# Altium schematic sheet SHT_5_I_Controller_07349-R5_L10.SchDoc
size B; CompanyName: Microchip Technology Inc.; Organization: Microchip Technology; Address1: 2355 West Chandler Blvd.; Address2: Chandler, AZ  85224; Address4: USA; SheetNumber: 5; SheetTotal: 9; SheetTitle: Current Measurement Control; Time: Time
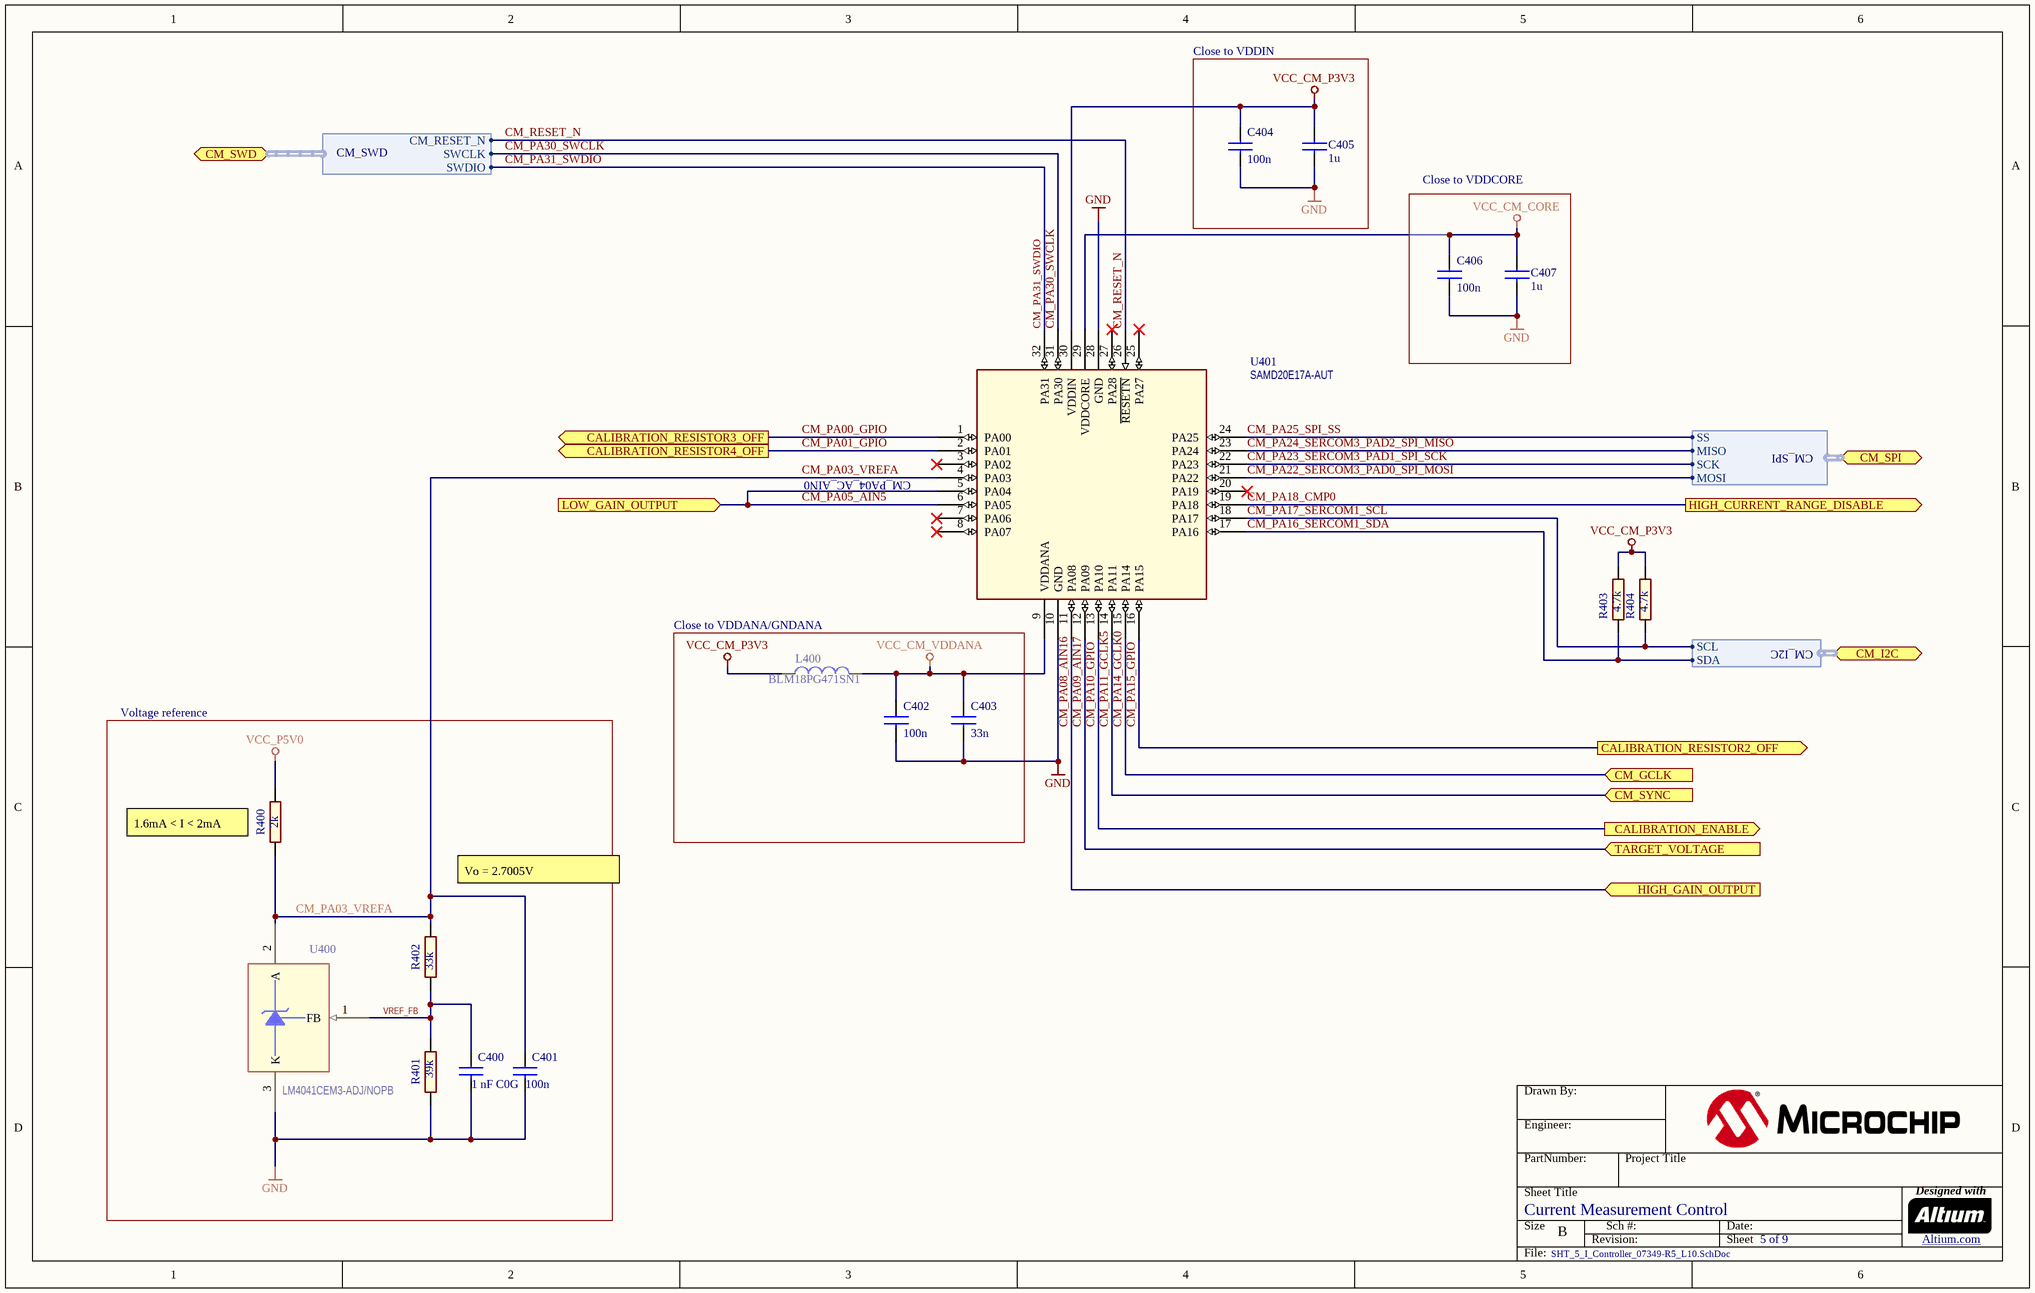
[diagram p0: SHT_5_I_Controller_07349-R5_L10.SchDoc]

## Parts
?  (no value)  (graphical)
C400  value 1 nF C0G  [AP1-00053]  (hidden comment: CAP-NONPOL)
C401  value 100n  [AP1-00053]
C402  value 100n  [AP1-00053]
C403  value 33n  [AP1-00053]
C404  value 100n  [AP1-00053]
C405  value 1u  [AP1-00001]  (hidden comment: CAP-NONPOL)
C406  value 100n  [AP1-00053]
C407  value 1u  [AP1-00001]  (hidden comment: CAP-NONPOL)
L400  value BLM18PG471SN1  [AP3-00005]
R400  value 2k  [AP2-00011]
R401  value 39k  [AP2-00011]
R402  value 33k  [AP2-00011]
R403  value 4.7k  [AP2-00011]
R404  value 4.7k  [AP2-00011]
U400  value LM4041CEM3-ADJ/NOPB  [AP5-00002]  (hidden comment: Updated with No-Pb part number and Texas Instruments mfc.)
U401  value SAMD20E17A-AUT  [AP6-00061]  (hidden comment: *)

## Blocks framed on the sheet
Close to VDDIN: C404 C405
Close to VDDCORE: C406 C407
Close to VDDANA/GNDANA: C402 C403 L400
Voltage reference: C400 C401 R400-R402 U400

## Ports
CALIBRATION_ENABLE (out), CALIBRATION_RESISTOR2_OFF (out), CALIBRATION_RESISTOR3_OFF (out), CALIBRATION_RESISTOR4_OFF (out), CM_GCLK (in), CM_I2C (harness CM_I2C), CM_SPI (harness CM_SPI), CM_SWD (harness CM_SWD), CM_SYNC (in), HIGH_CURRENT_RANGE_DISABLE (out), HIGH_GAIN_OUTPUT (in), LOW_GAIN_OUTPUT (in), TARGET_VOLTAGE (in)

## Harnesses
CM_SPI: MISO, MOSI, SCK, SS
CM_I2C: SCL, SDA
CM_SWD: SWCLK, SWDIO, CM_RESET_N

## Nets
GND: C400.2 C401.2 C402.2 C403.2 C404.2 C405.2 C406.2 C407.2 R401.1 U400.3(K) U401.10(GND) U401.28(GND)
VCC_CM_CORE: C406.1 C407.1 U401.29(VDDCORE)
VCC_CM_P3V3: C404.1 C405.1 L400.1 R403.2 R404.2 U401.30(VDDIN)
VCC_CM_VDDANA: C402.1 C403.1 L400.2 U401.9(VDDANA)
VCC_P5V0: R400.2
CM_PA00_GPIO: U401.1(PA00) ; port CALIBRATION_RESISTOR3_OFF
CM_PA01_GPIO: U401.2(PA01) ; port CALIBRATION_RESISTOR4_OFF
CM_PA03_VREFA: C401.1 R400.1 R402.2 U400.2(A) U401.4(PA03)
CM_PA05_AIN5: U401.5(PA04) U401.6(PA05) ; port LOW_GAIN_OUTPUT
CM_PA08_AIN16: U401.11(PA08) ; port HIGH_GAIN_OUTPUT
CM_PA09_AIN17: U401.12(PA09) ; port TARGET_VOLTAGE
CM_PA10_GPIO: U401.13(PA10) ; port CALIBRATION_ENABLE
CM_PA11_GCLK5: U401.14(PA11) ; port CM_SYNC
CM_PA14_GCLK0: U401.15(PA14) ; port CM_GCLK
CM_PA15_GPIO: U401.16(PA15) ; port CALIBRATION_RESISTOR2_OFF
CM_PA16_SERCOM1_SDA: R403.1 U401.17(PA16) ; port CM_I2C.SDA
CM_PA17_SERCOM1_SCL: R404.1 U401.18(PA17) ; port CM_I2C.SCL
CM_PA18_CMP0: U401.19(PA18) ; port HIGH_CURRENT_RANGE_DISABLE
CM_PA22_SERCOM3_PAD0_SPI_MOSI: U401.21(PA22) ; port CM_SPI.MOSI
CM_PA23_SERCOM3_PAD1_SPI_SCK: U401.22(PA23) ; port CM_SPI.SCK
CM_PA24_SERCOM3_PAD2_SPI_MISO: U401.23(PA24) ; port CM_SPI.MISO
CM_PA25_SPI_SS: U401.24(PA25) ; port CM_SPI.SS
CM_PA30_SWCLK: U401.31(PA30) ; port CM_SWD.SWCLK
CM_PA31_SWDIO: U401.32(PA31) ; port CM_SWD.SWDIO
CM_RESET_N: U401.26(~{RESETN}) ; port CM_SWD.CM_RESET_N
VREF_FB: C400.1 R401.2 R402.1 U400.1(FB)

Not connected (* = marked no-connect by the designer): U401 3(PA02)* 7(PA06)* 8(PA07)* 20(PA19)* 25(PA27)* 27(PA28)*

## Notes on the sheet
- CM_PA04_AC_AIN0
- (near R400) 1.6mA < I < 2mA
- Vo = 2.7005V
- Drawn By:
- Engineer:
- PartNumber:
- Project Title
- Sheet Title
- Size
- B
- Revision:
- Sch #:
- Date:
- Sheet
- Designed with
- Altium.com <http://go.altium.com/MicrochipLandingPage_Evaluation.html>
- File:

## Library data of the parts
? = Title Block B
C400 = A01-0321: Ceramic capacitor, SMD 0402, C0G, 50V, +/-5%; PartGroup: Capacitors,Ceramic,SMD 0402; Manufacturer: Murata; MPN: GRM1555C1H102JA01D; Tolerance: 5%; ComponentStatus: 'Active (verified)'; Status: Active; Verified by: Lars Helge Mo; Verified date: 2005-12-15; AN: A01-0321; Height: 0.550000011920929; FootprintStatus: 'Active (Verified)'
C401 C402 C404 C406 = A01-0246: Ceramic capacitor, SMD 0402, X7R, 16V, +/-10%; PartGroup: Capacitors,Ceramic,SMD 0402; Manufacturer: Kemet; MPN: C0402C104K4RACTU; TemperatureRange: -55 - +125 deg C; ComponentStatus: 'Active (verified)'; Status: Active; Verified by: Lars Helge Mo; Verified date: 2005-12-15; AN: A01-0246; Tolerance: 16V, +/-10%; Height: 0.5; FootprintStatus: 'Active (Verified)'
C403 = A01-0397: Ceramic capacitor, SMD 0402, X7R, 25V, ±10%; PartGroup: Capacitors,Ceramic,SMD 0402; Manufacturer: Murata; MPN: GRM155R71E333KA88D; Tolerance: ±10%(K); TemperatureRange: -55 to 125°C; ComponentStatus: 'Active (verified)'; Status: Active; Verified by: Lars Helge Mo; Verified date: 2005-12-15; AN: A01-0397; Height: 0.5; FootprintStatus: 'Active (Verified)'
C405 C407 = A01-0286: Ceramic capacitor, SMD 0402, X5R, 6.3V, +/-10% (de26942); PartGroup: Capacitors,Ceramic,SMD 0402; Manufacturer: Kemet; MPN: C0402C105K9PAC; ComponentStatus: 'Active (verified)'; TemperatureRange: -55 to 85 deg C; Status: Active; Verified by: Lars Helge Mo; Verified date: 2005-12-15; AN: A01-0286; Tolerance: +/-10%; Height: 0.5; FootprintStatus: 'Active (Verified)'
L400 = A03-0035: SMD RF inductor 0603. Z=470Ohm (@100MHz), Max R(dc)=0.65Ohm, Max current=1A; PartGroup: Inductors,EMI; Manufacturer: Murata; TemperatureRange: -55; ComponentStatus: 'Active (verified)'; Verified date: 2006-01-30; Verified by: Lars Helge Mo; Status: Active; AN: A03-0035; Height: 0,800000011920929; MPN: BLM18PG471SN1; FootprintStatus: 'Active (Verified)'
R400 = A02-0219: Thick film resistor, SMD 0402, 1/16W, 1%; PartGroup: Resistors,SMD,0402 1%; MPN: RC0402FR-072KL; Manufacturer: YAGEO CORP; TemperatureRange: -55 - +125 deg C; ComponentStatus: 'Active (verified)'; Status: Active; Verified by: Lars Helge Mo; Verified date: 2005-12-19; AN: A02-0219; Tolerance: 1 %; Height: 0.349999994039536; FootprintStatus: 'Active (Verified)'
R401 = A02-0250: Thick film resistor, SMD 0402, 1/16W, 1%; PartGroup: Resistors,SMD,0402 1%; Manufacturer: ASJ; MPN: CR10-3902-FK; TemperatureRange: -55 - +125 deg C; ComponentStatus: 'Active (verified)'; Status: Active; Verified by: Lars Helge Mo; Verified date: 2005-12-19; AN: A02-0250; Tolerance: 1 %; Height: 0.349999994039536; FootprintStatus: 'Active (Verified)'
R402 = A02-0248: Thick film resistor, SMD 0402, 1/16W, 1%; PartGroup: Resistors,SMD,0402 1%; Manufacturer: ASJ; MPN: CR10-3302-FK; TemperatureRange: -55 - +125 deg C; ComponentStatus: 'Active (verified)'; Status: Active; Verified by: Lars Helge Mo; Verified date: 2005-12-19; AN: A02-0248; Tolerance: 1 %; Height: 0.349999994039536; FootprintStatus: 'Active (Verified)'
R403 R404 = A02-0228: Thick film resistor, SMD 0402, 1/16W, 1%; PartGroup: Resistors,SMD,0402 1%; Manufacturer: PHYCOMP; MPN: 2322 706 74702L; TemperatureRange: -55ï¿½ to +125ï¿½C; ComponentStatus: 'Active (verified)'; Status: Active; Verified by: Lars Helge Mo; Verified date: 2005-12-19; AN: A02-0228; Tolerance: 1 %; Height: 0.349999994039536; FootprintStatus: 'Active (Verified)'
U400 = A06-0123: Adjustable shunt voltage regulator, 1.24 to 10V out; PartGroup: Integrated Circuits,Regulators,Voltage reference; TemperatureRange: -40 to +85 deg. C; ComponentStatus: 'Active (verified)'; Status: Active; AN: A06-0123; Height: 1; Manufacturer: Texas Instruments; MPN: LM4041CEM3-ADJ/NOPB; FootprintStatus: 'Active (Verified)'
U401 = A06-1023: Atmel 32bit RISC MCU 32 pin; PartGroup: Integrated Circuits,MCU, MPU, DSP,ARM MCU; MPN: ATSAMD20E17A-AUT; ComponentStatus: 'Active (verified)'; Verified date: *; Verified by: *; Status: *; Design comment: *; AN: A06-1023; Height: 1.20000004768372; Manufacturer: ATMEL; FootprintStatus: 'Active (Verified)'